# Altium schematic sheet [13] - AUDIO.SchDoc
size A3; DocumentNumber: 13; SheetNumber: 13; SheetTotal: 18
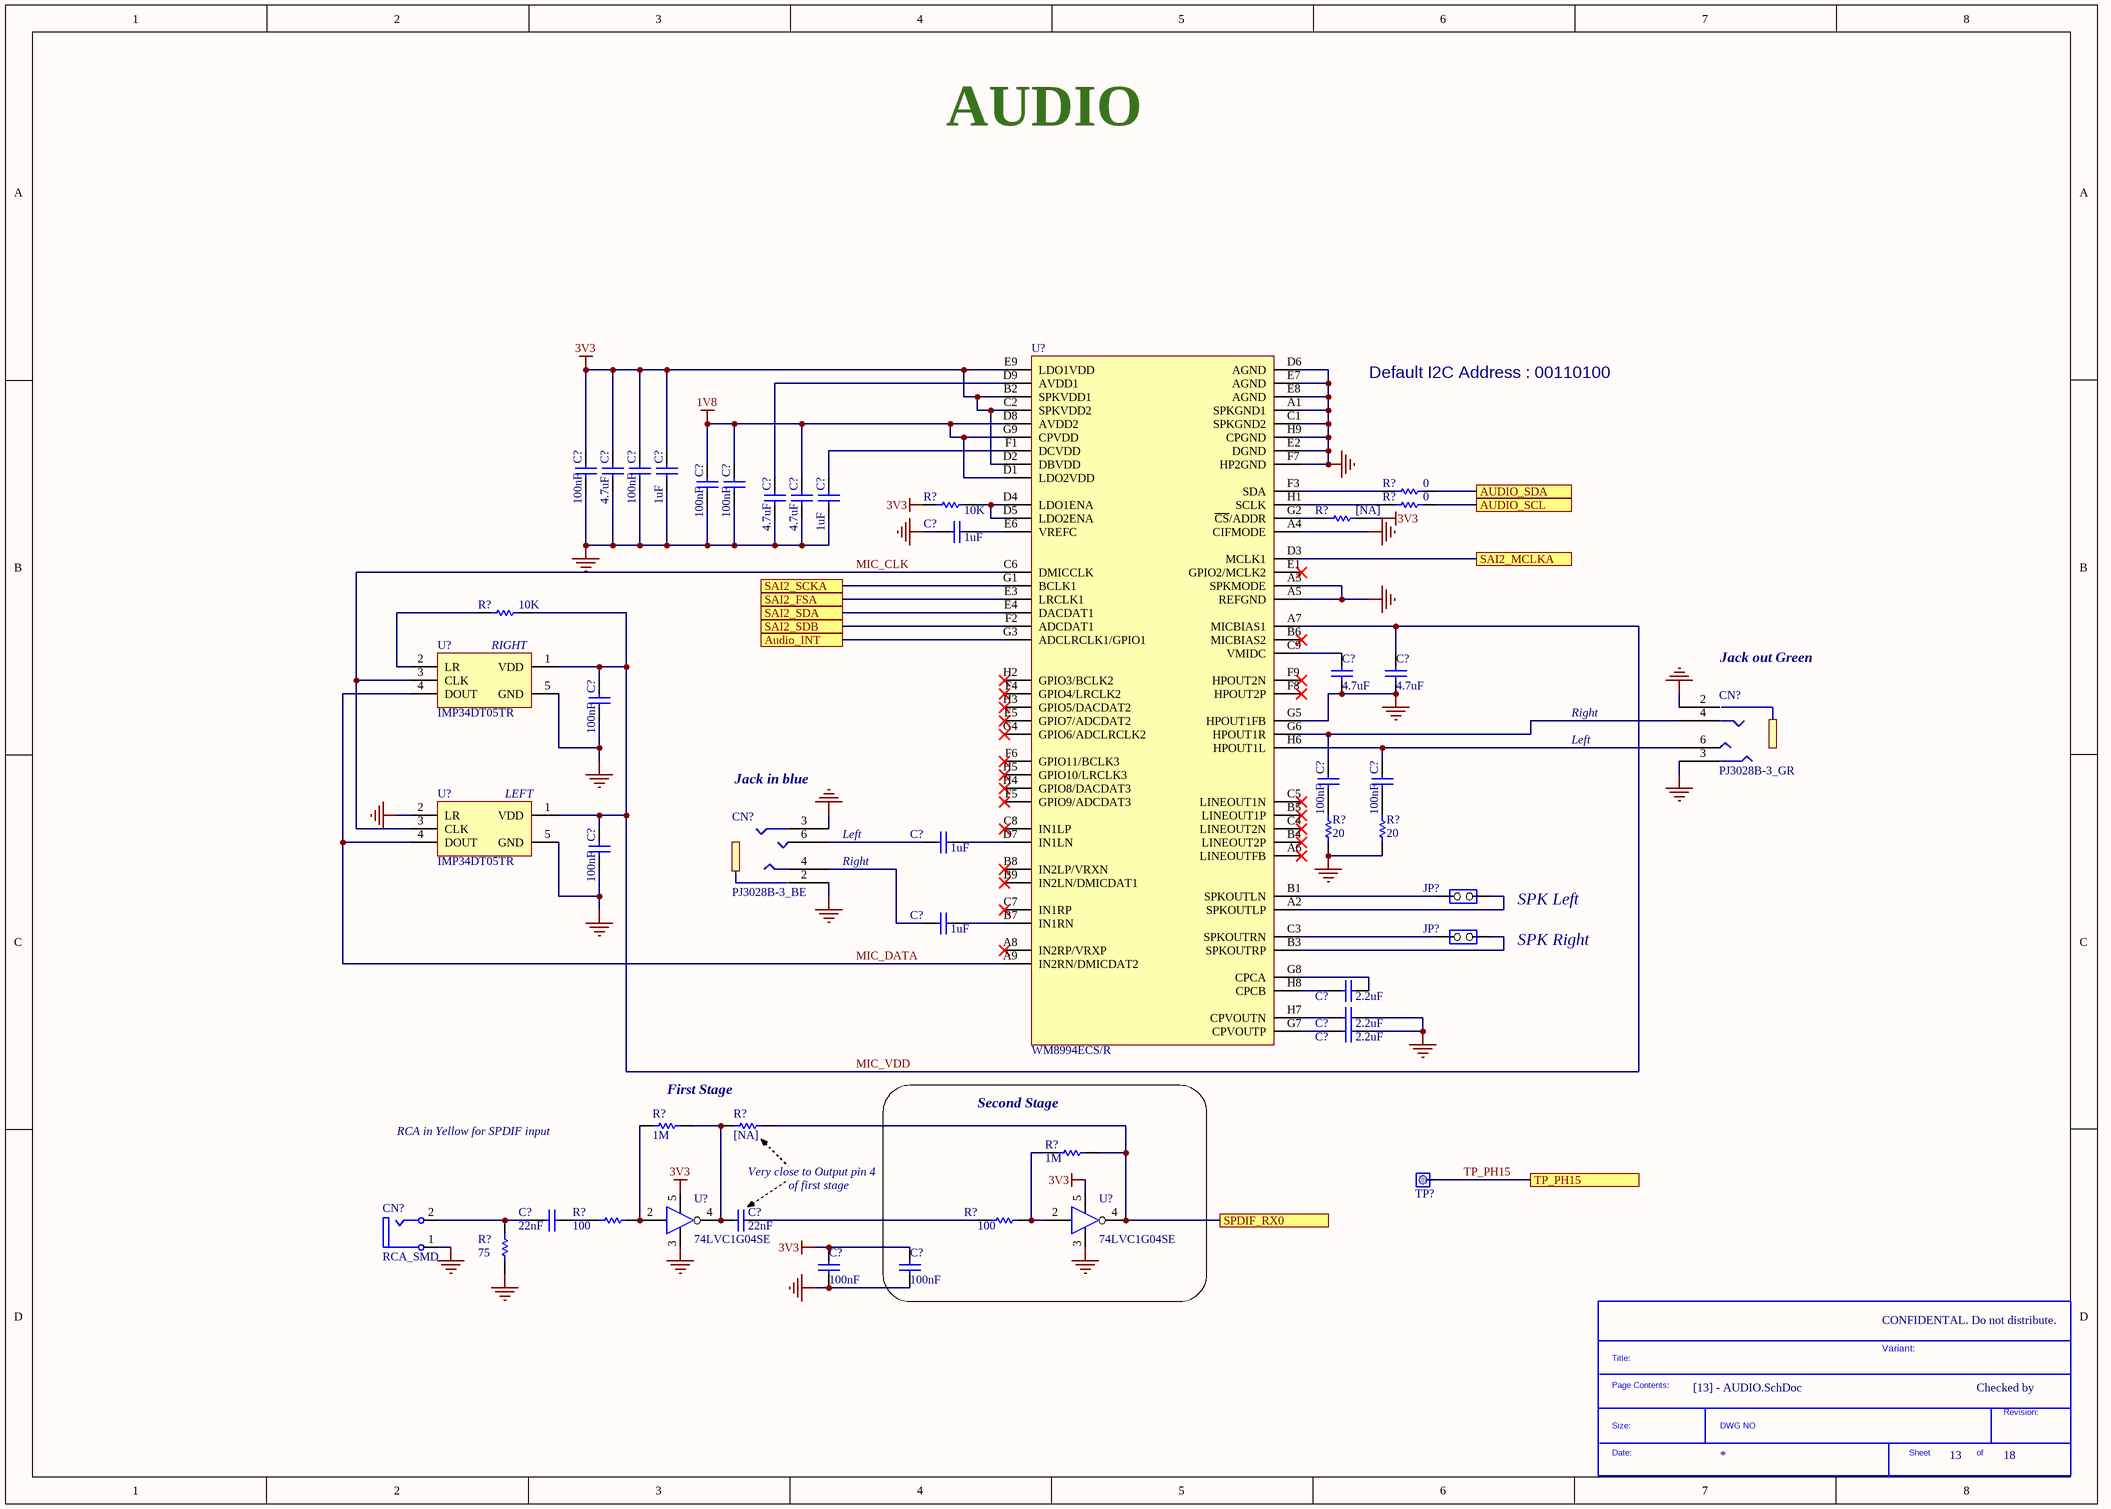
[diagram p0: [13] - AUDIO.SchDoc]

## Parts
(Parts that share a designator on the sheet are numbered #1, #2 ... from top to bottom, then left to right.)
*  SDTitleBlock  (value not drawn)  (graphical)
C?#1  100nF  [0402C]
C?#2  4.7uF  [0603C]
C?#3  100nF  [0402C]
C?#4  1uF  [0603C]
C?#5  100nF  [0402C]
C?#6  100nF  [0402C]
C?#7  4.7uF  [0603C]
C?#8  4.7uF  [0603C]
C?#9  1uF  [0603C]
C?#10  1uF  [0603C]
C?#11  4.7uF  [0603C]
C?#12  4.7uF  [0603C]
C?#13  100nF  [0402C]
C?#14  100nF  [0402C]
C?#15  100nF  [0402C]
C?#16  100nF  [0402C]
C?#17  1uF  [0603C]
C?#18  1uF  [0603C]
C?#19  2.2uF  [0603C]
C?#20  2.2uF  [0603C]
C?#21  2.2uF  [0603C]
C?#22  22nF  [0402C]
C?#23  22nF  [0402C]
C?#24  100nF  [0402C]
C?#25  100nF  [0402C]
CN?#1  PJ3028B-3_GR  [PJ3028B]
CN?#2  PJ3028B-3_BE  [PJ3028B]
CN?#3  RCA_SMD  [RCA_SMD]
JP?#1  Jumper 2 pins  [SIP2/2.54]  (value not drawn)
JP?#2  Jumper 2 pins  [SIP2/2.54]  (value not drawn)
R?#1  [NA]  [0402R]
R?#2  0  [0402R]
R?#3  10K  [0402R]
R?#4  0  [0402R]
R?#5  10K  [0402R]
R?#6  20  [0402R]
R?#7  20  [0402R]
R?#8  1M  [0402R]
R?#9  [NA]  [0402R]
R?#10  1M  [0402R]
R?#11  100  [0402R]
R?#12  100  [0402R]
R?#13  75  [0402R]
TP?  Test point 1 pin with hole  [SIP1/2.54]  (value not drawn)
U?#1  WM8994ECS/R  [BGA72_0R5_4R5X4]
U?#2  IMP34DT05TR  [HCLGA_3X4X1_4LD]
U?#3  IMP34DT05TR  [HCLGA_3X4X1_4LD]
U?#4  74LVC1G04SE  [SOT353]
U?#5  74LVC1G04SE  [SOT353]

## Blocks framed on the sheet
Second Stage: C?#25 R?#10 R?#12 U?#5

## Ports
Audio_INT, AUDIO_SCL, AUDIO_SDA, SAI2_FSA, SAI2_MCLKA, SAI2_SCKA, SAI2_SDA, SAI2_SDB, SPDIF_RX0, TP_PH15

## Nets
1V8: C?#5.1 C?#6.1 C?#8.1 U?#1.D1(LDO2VDD) U?#1.D8(AVDD2) U?#1.G9(CPVDD)
3V3: C?#1.1 C?#2.1 C?#3.1 C?#4.2 C?#24.2 C?#25.2 R?#1.2 R?#3.2 U?#1.B2(SPKVDD1) U?#1.C2(SPKVDD2) U?#1.D2(DBVDD) U?#1.E9(LDO1VDD) U?#4.5(VCC) U?#5.5(VCC)
GND: C?#1.2 C?#2.2 C?#3.2 C?#4.1 C?#5.2 C?#6.2 C?#7.2 C?#8.2 C?#9.1 C?#10.2 C?#11.1 C?#12.1 C?#13.2 C?#16.2 C?#20.2 C?#21.2 C?#24.1 C?#25.1 CN?#1.2 CN?#1.3 CN?#2.2 CN?#2.3 CN?#3.1(Ground) R?#6.2 R?#7.2 R?#13.1 U?#1.A1(SPKGND1) U?#1.A3(SPKMODE) U?#1.A4(CIFMODE) U?#1.A5(REFGND) U?#1.C1(SPKGND2) U?#1.D6(AGND) U?#1.E2(DGND) U?#1.E7(AGND) U?#1.E8(AGND) U?#1.F7(HP2GND) U?#1.G5(HPOUT1FB) U?#1.H9(CPGND) U?#2.5(GND) U?#3.2(LR) U?#3.5(GND) U?#4.3(GND) U?#5.3(GND)
Audio_INT: U?#1.G3(ADCLRCLK1/GPIO1) ; port Audio_INT
AUDIO_SCL: R?#4.1 ; port AUDIO_SCL
AUDIO_SDA: R?#2.1 ; port AUDIO_SDA
MIC_CLK: U?#1.C6(DMICCLK) U?#2.3(CLK) U?#3.3(CLK)
MIC_DATA: U?#1.A9(IN2RN/DMICDAT2) U?#2.4(DOUT) U?#3.4(DOUT)
MIC_VDD: C?#12.2 C?#13.1 C?#16.1 R?#5.2 U?#1.A7(MICBIAS1) U?#2.1(VDD) U?#3.1(VDD)
SAI2_FSA: U?#1.E3(LRCLK1) ; port SAI2_FSA
SAI2_MCLKA: U?#1.D3(MCLK1) ; port SAI2_MCLKA
SAI2_SCKA: U?#1.G1(BCLK1) ; port SAI2_SCKA
SAI2_SDA: U?#1.E4(DACDAT1) ; port SAI2_SDA
SAI2_SDB: U?#1.F2(ADCDAT1) ; port SAI2_SDB
SPDIF_RX0: R?#9.2 R?#10.2 U?#5.4(Y) ; port SPDIF_RX0
TP_PH15: TP?.1(COMMON) ; port TP_PH15
NetC?#7_1: C?#7.1 U?#1.D9(AVDD1)
NetC?#9_2: C?#9.2 U?#1.F1(DCVDD)
NetC?#10_1: C?#10.1 U?#1.E6(VREFC)
NetC?#11_2: C?#11.2 U?#1.C9(VMIDC)
NetC?#14_1: C?#14.1 CN?#1.4 U?#1.G6(HPOUT1R)
NetC?#14_2: C?#14.2 R?#6.1
NetC?#15_1: C?#15.1 CN?#1.6 U?#1.H6(HPOUT1L)
NetC?#15_2: C?#15.2 R?#7.1
NetC?#17_1: C?#17.1 U?#1.D7(IN1LN)
NetC?#17_2: C?#17.2 CN?#2.6
NetC?#18_1: C?#18.1 U?#1.B7(IN1RN)
NetC?#18_2: C?#18.2 CN?#2.4
NetC?#19_1: C?#19.1 U?#1.H8(CPCB)
NetC?#19_2: C?#19.2 U?#1.G8(CPCA)
NetC?#20_1: C?#20.1 U?#1.H7(CPVOUTN)
NetC?#21_1: C?#21.1 U?#1.G7(CPVOUTP)
NetC?#22_1: C?#22.1 CN?#3.2(Signal) R?#13.2
NetC?#22_2: C?#22.2 R?#11.1
NetC?#23_1: C?#23.1 R?#8.2 R?#9.1 U?#4.4(Y)
NetC?#23_2: C?#23.2 R?#12.1
NetJP?#1_1: JP?#1.1(COMMON) U?#1.B1(SPKOUTLN)
NetJP?#1_2: JP?#1.2(NO) U?#1.A2(SPKOUTLP)
NetJP?#2_1: JP?#2.1(COMMON) U?#1.C3(SPKOUTRN)
NetJP?#2_2: JP?#2.2(NO) U?#1.B3(SPKOUTRP)
NetR?#1_1: R?#1.1 U?#1.G2(~{CS}/ADDR)
NetR?#2_2: R?#2.2 U?#1.F3(SDA)
NetR?#3_1: R?#3.1 U?#1.D4(LDO1ENA) U?#1.D5(LDO2ENA)
NetR?#4_2: R?#4.2 U?#1.H1(SCLK)
NetR?#5_1: R?#5.1 U?#2.2(LR)
NetR?#8_1: R?#8.1 R?#11.2 U?#4.2(A)
NetR?#10_1: R?#10.1 R?#12.2 U?#5.2(A)

Not connected (* = marked no-connect by the designer): U?#1 A6(LINEOUTFB)* A8(IN2RP/VRXP)* B4(LINEOUT2P)* B5(LINEOUT1P)* B6(MICBIAS2)* B8(IN2LP/VRXN)* B9(IN2LN/DMICDAT1)* C4(LINEOUT2N)* C5(LINEOUT1N)* C7(IN1RP)* C8(IN1LP)* E1(GPIO2/MCLK2)* E5(GPIO7/ADCDAT2)* F4(GPIO4/LRCLK2)* F5(GPIO9/ADCDAT3)* F6(GPIO11/BCLK3)* F8(HPOUT2P)* F9(HPOUT2N)* G4(GPIO6/ADCLRCLK2)* H2(GPIO3/BCLK2)* H3(GPIO5/DACDAT2)* H4(GPIO8/DACDAT3)* H5(GPIO10/LRCLK3)*; U?#4 1(NC); U?#5 1(NC)

## Notes on the sheet
- AUDIO
- Default I2C Address : 00110100
- (near U?#2) RIGHT
- Right
- (near CN?#1) Jack out Green
- (near CN?#2) Jack in blue
- Left
- (near U?#3) LEFT
- (near JP?#1) SPK Left
- (near JP?#2) SPK Right
- (near R?#8) First Stage
- RCA in Yellow for SPDIF input
- Very close to Output pin 4
- of first stage
- CONFIDENTAL. Do not distribute.
- CLOCKS (CPU & PCIE)
- Variant:
- Checked by
- (in symbol SDTitleBlock) Title:; Page Contents:; Revision:; Size:; DWG NO; Date:; Sheet; of

## Library data of the parts
C?#1 C?#3 C?#5 C?#6 C?#13-C?#16 C?#24 C?#25 = Cap_100nF_X7R_10%_0402: Capacitor,100nF,16V,X7R,10%,0402,YAGEO; Manuf_Part_1: CC0402KRX7R7BB104; Revision: July-2002: Re-released for DXP Platform.; Value: 100nF; Order: CC0402KRX7R7BB104; Manuf_1: YAGEO
  C?#1 C?#3 C?#5 C?#6 C?#13-C?#16: ECCN_US/EU: n/a
C?#2 C?#7 C?#8 C?#11 C?#12 = Cap_4.7uF_X5R_10%_0603: Capacitor,4.7uF,16V, X5R,10%,0603,YAGEO; Manuf_Part_1: CC0603KRX5R7BB475; Order: CC0603KRX5R7BB105; Revision: July-2002: Re-released for DXP Platform.; Value: 4.7uF; Manuf_1: YAGEO; ECCN_US/EU: n/a
C?#4 C?#9 C?#10 C?#17 C?#18 = Cap_1uF_X5R_10%_0603: Capacitor,1uF,16V,X5R,10%,0603,YAGEO; Manuf_Part_1: CC0603KRX5R7BB105; Revision: July-2002: Re-released for DXP Platform.; Value: 1uF; Order: CC0603KRX5R7BB105; Manuf_1: YAGEO; ECCN_US/EU: n/a
C?#19-C?#21 = Cap_2.2uF_X5R_10%_0603: Capacitor,2.2uF,10V, X5R,10%,0603,YAGEO; Manuf_Part_1: CC0603KRX5R6BB225; Manuf_Part_2: C0603C225K8PACTU; Manuf_2: KEMET; Revision: July-2002: Re-released for DXP Platform.; Value: 2.2uF; Order: *; Manuf_1: YAGEO; ECCN_US/EU: n/a
C?#22 C?#23 = Cap_22nF_X7R_10%_0402: Capacitor,22nF,16V,X7R,10%,0402,YAGEO; Manuf_Part_1: CC0402KRX7R7BB223; Revision: July-2002: Re-released for DXP Platform.; Value: 22nF; Order: CC0402KRX7R7BB223; Manuf_1: YAGEO; ECCN_US/EU: n/a
CN?#1 = PJ3028B-3_GR: Connector Jack Stereo 3.5mm, female SMT, Green (Line output); Manuf_1: qiaod; Manuf_Part_2: PJ30280-3_GR; ECCN_US/EU: n/a; Manuf_Part_1: PJ3028B-3_GR
CN?#2 = PJ3028B-3_BE: Connector Jack Stereo 3.5mm, female SMT, Blue (Line input); Manuf_1: qiaod; Manuf_Part_2: PJ30280-3_BE; ECCN_US/EU: n/a; Manuf_Part_1: PJ3028B-3_BE
CN?#3 = RCA_SMD: RCA Phono Jack, Right Angle, SMD, Yellow; Manuf_Part_1: JBB0819100002; Manuf_1: Jiubaba
JP?#1 JP?#2 = Jumper2: Fitted: NO; ECCN_US/EU: n/a
R?#1 R?#9 = Res_NA_0402: Resistor,[NA],0402; Fitted: NO; Value: [NA]; ECCN_US/EU: n/a
R?#2 R?#4 = Res_0_5%_0402: Resistor,0,0402,5%,YAGEO; Manuf_Part_1: RC0402JR-070RL; Order: 2363467; Value: 0; ECCN_US/EU: n/a; Manuf_1: YAGEO; Distrib: FARNELL
R?#3 R?#5 = Res_10K_1%_0402: Resistor,10K,0402,1%,YAGEO; Manuf_Part_1: RC0402FR-0710KL; Value: 10K; Manuf_1: YAGEO; Order: RC0402FR-0710KL; ECCN_US/EU: n/a
R?#6 R?#7 = Res_20_1%_0402: Resistor,20,0402,1%,YAGEO; Manuf_Part_1: RC0402FR-0720RL; Value: 20; Manuf_1: YAGEO; Order: *; ECCN_US/EU: n/a
R?#8 R?#10 = Res_1M_1%_0402: Resistor,1M,0402,1%,YAGEO; Manuf_Part_1: RC0402FR-071ML; Value: 1M; Manuf_1: YAGEO; Order: RC0402FR-071ML; ECCN_US/EU: n/a
R?#11 R?#12 = Res_100_1%_0402: Resistor,100,0402,1%,YAGEO; Manuf_Part_1: RC0402FR-07100RL; Order: 9239111; Value: 100; Manuf_1: YAGEO; ECCN_US/EU: n/a; Distrib: FARNELL
R?#13 = Res_75_1%_0402: Resistor,75,0402,1%,YAGEO; Manuf_Part_1: RC0402FR-0775RL; Order: 311-75.0LRTR-ND; Value: 75; Manuf_1: YAGEO; ECCN_US/EU: n/a; Distrib: DIGIKEY
TP? = TP1: Test Point; Fitted: NO; ECCN_US/EU: n/a
U?#1 = WM8994ECS/R: Multi-Channel Audio Hub CODEC for Smartphones; Manuf_1: Cirrus Logic; ECCN_US/EU: EAR99/NEC; Manuf_Part_1: WM8994ECS/R; Distrib: Cirrus Logic
U?#2 U?#3 = IMP34DT05TR: MEMS audio sensor omnidirectional digital microphone for industrial applications; Manuf_1: STMICROELECTRONICS; ECCN_US/EU: EAR99/NEC; provided: SUBCO with ST control; Manuf_Part_1: IMP34DT05TR; value: IMP34DT05TR
U?#4 U?#5 = 74LVC1G04SE: Single inverter gate with a standard push-pull output. (1.65V to 5.5V); Manuf_Part_1: 74LVC1G04SE-7; Manuf_1: DIODES; Order: 1845218; ECCN_US/EU: EAR99/NEC; Distrib: FARNELL